# EAGLE schematic GPS_radiologger_v1 (EAGLE 9.4.2)
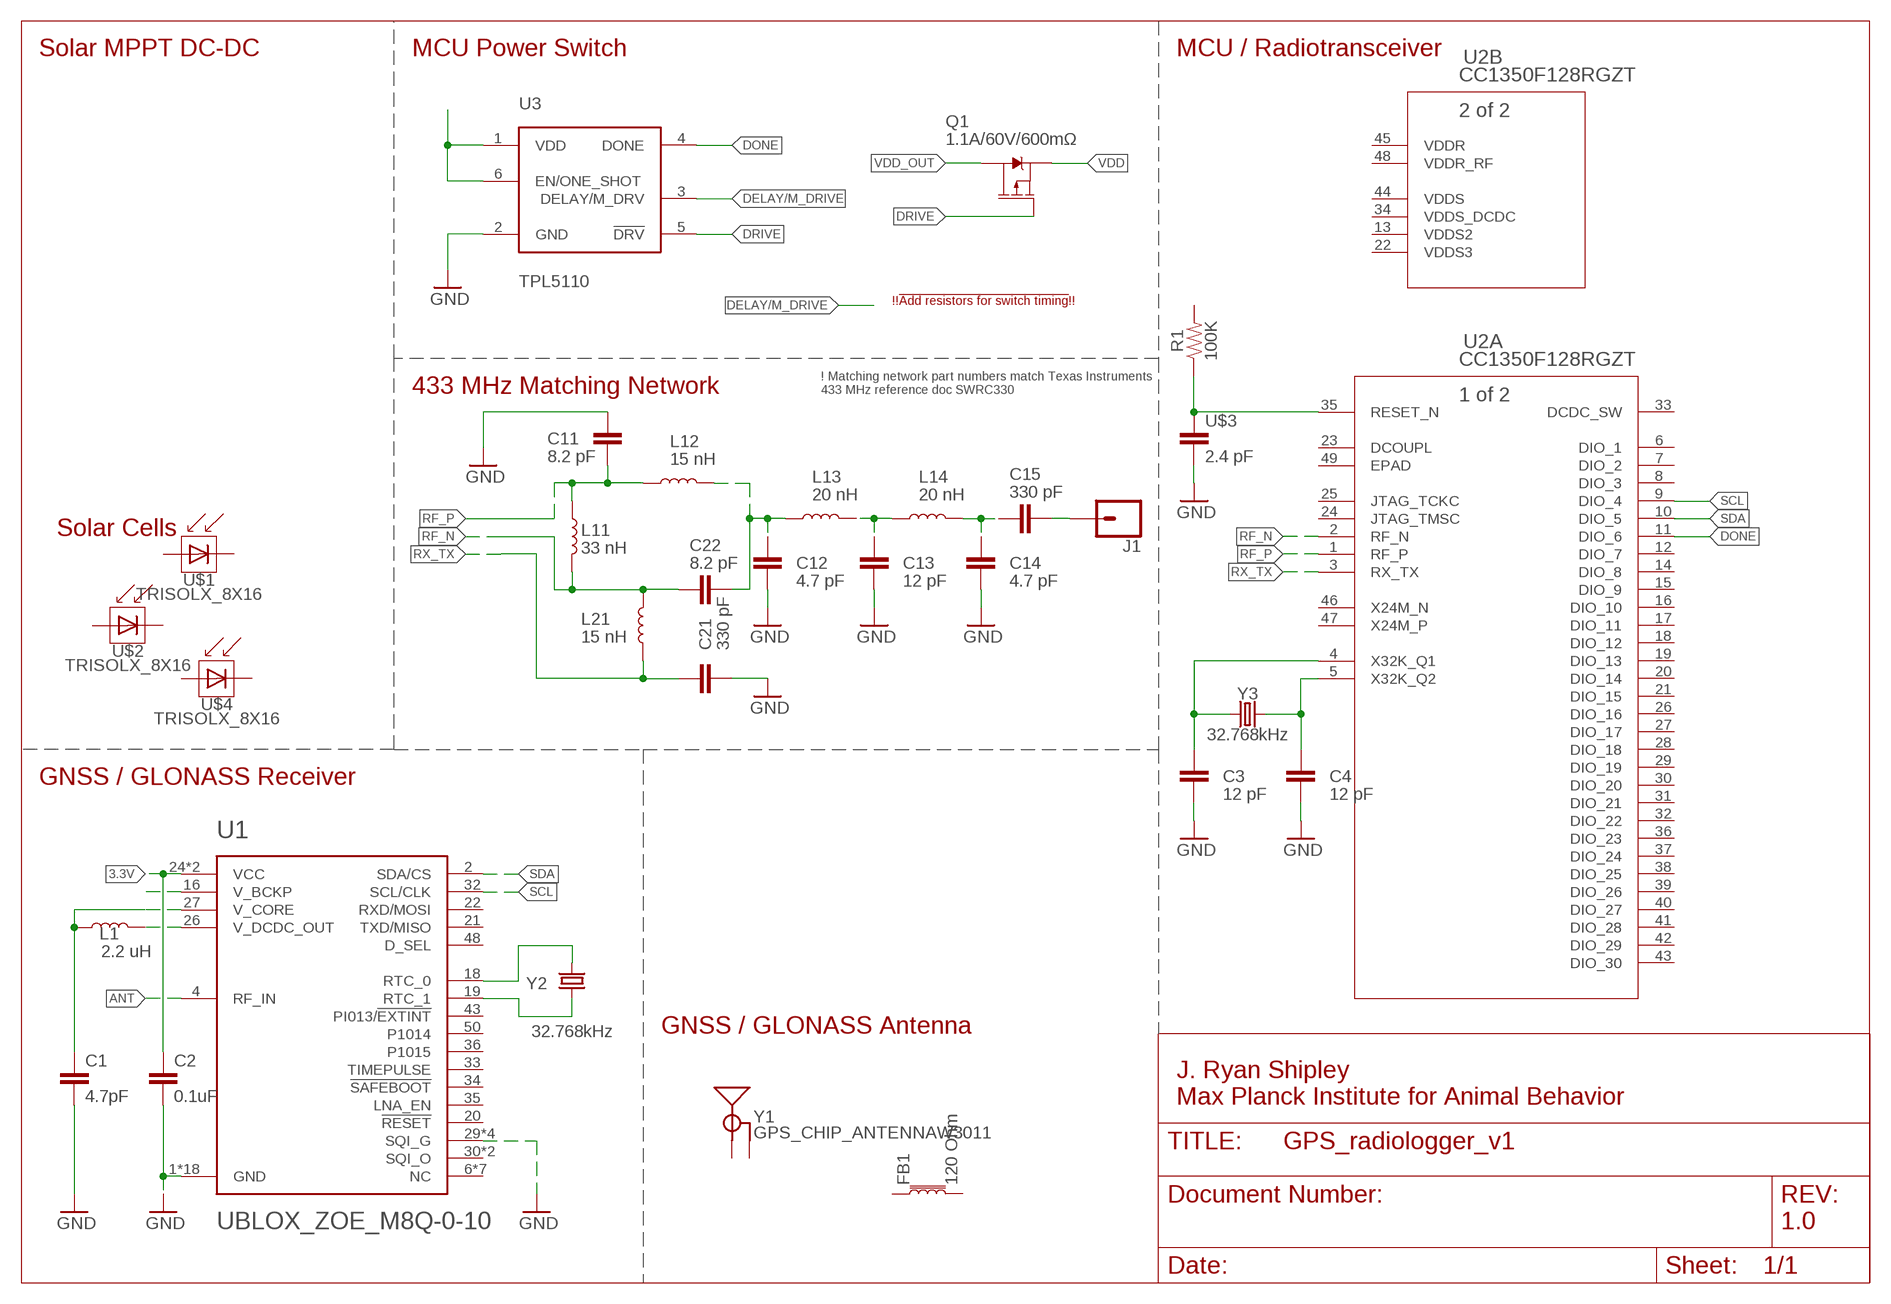
[diagram p0: schematic, sheet 1]

## Parts
C1  4.7pF  4.7PF-0603-50V-5%  [0603]
C2  0.1uF  0.1UF-0402-16V-10%  [0402]
C3  12 pF  0.1UF-0402T-16V-10%  [0402-TIGHT]
C4  12 pF  0.1UF-0402T-16V-10%  [0402-TIGHT]
C11  8.2 pF  0.1UF-0402T-16V-10%  [0402-TIGHT]
C12  4.7 pF  0.1UF-0402T-16V-10%  [0402-TIGHT]
C13  12 pF  0.1UF-0402T-16V-10%  [0402-TIGHT]
C14  4.7 pF  0.1UF-0402T-16V-10%  [0402-TIGHT]
C15  330 pF  0.1UF-0402T-16V-10%  [0402-TIGHT]
C21  330 pF  0.1UF-0402T-16V-10%  [0402-TIGHT]
C22  8.2 pF  0.1UF-0402T-16V-10%  [0402-TIGHT]
FB1  120 Ohm  FERRITE_BEAD-120_OHM-0402  [0402]
J1  CONN_01OFFSET  [1X01_OFFSET]
L1  2.2 uH  2.2μH_SHIELDED_INDUCTOR  [0806]
L11  33 nH  19NH-0402  [0402_MURATA]
L12  15 nH  19NH-0402  [0402_MURATA]
L13  20 nH  19NH-0402  [0402_MURATA]
L14  20 nH  19NH-0402  [0402_MURATA]
L21  15 nH  19NH-0402  [0402_MURATA]
Q1  1.1A/60V/600mΩ  MOSFET_PCH-SI2309DS  [SOT23-3]
R1  100K  100KOHM-0402-1/16W-1%  [0402]
U1  UBLOX_ZOE_M8Q-0-10  [UBLOX_ZOE_M8-0-10]
U2  CC1350F128RGZT  [RGZ48]
U3  TPL5110  [SOT23-6]
U$1  TRISOLX_8X16  [TRISOLX_8X16]
U$2  TRISOLX_8X16  [TRISOLX_8X16]
U$3  2.4 pF  2.4PF-0402  [0402_MURATA]
U$4  TRISOLX_8X16  [TRISOLX_8X16]
Y1  GPS_CHIP_ANTENNAW3011  [W3011]
Y2  32.768kHz  CRYSTAL-32.768KHZSMD-3.2X1.5  [CRYSTAL-SMD-3.2X1.5MM]
Y3  32.768kHz  CRYSTAL-32.768KHZSMD-3.2X1.5  [CRYSTAL-SMD-3.2X1.5MM]

## Nets
3.3V: C2.1 U1.24(VCC) U1.25(VCC)
ANT: U1.4(RF_IN)
DELAY/M_DRIVE: U3.3(DELAY/M_DRV)
DONE: U2.11(A:DIO_6) U3.4(DONE)
DRIVE: Q1.1(G) U3.5(!DRV)
GND: C1.2 C2.2 C3.2 C4.2 C11.2 C12.2 C13.2 C14.2 C21.2 U1.1(GND) U1.3(GND) U1.5(GND) U1.7(GND) U1.8(GND) U1.9(GND) U1.10(GND) U1.11(GND) U1.12(GND) U1.17(GND) U1.23(GND) U1.29(SQI_G) U1.31(SQI_G) U1.37(GND) U1.38(GND) U1.39(GND) U1.40(GND) U1.41(GND) U1.44(GND) U1.46(SQI_G) U1.47(SQI_G) U1.49(GND) U3.2(GND) U$3.P$2
N$1: U1.16(V_BCKP)
N$2: C1.1 L1.1 U1.27(V_CORE)
N$3: L1.2 U1.26(V_DCDC_OUT)
N$4: U1.18(RTC_0) Y2.P$2
N$5: U1.19(RTC_1) Y2.P$1
N$6: U3.1(VDD) U3.6(EN/ONE_SHOT)
N$7: C13.1 L13.P$2 L14.P$1
N$8: C14.1 C15.1 L14.P$2
N$9: C12.1 C22.1 L12.P$2 L13.P$1
N$10: C15.2 J1.1
N$11: C3.1 U2.4(A:X32K_Q1) Y3.P$1
N$12: C4.1 U2.5(A:X32K_Q2) Y3.P$2
N$13: R1.1 U2.35(A:RESET_N) U$3.P$1
RF_N: C22.2 L11.P$2 L21.P$2 U2.2(A:RF_N)
RF_P: C11.1 L11.P$1 L12.P$1 U2.1(A:RF_P)
RX_TX: C21.1 L21.P$1 U2.3(A:RX_TX)
SCL: U1.32(SCL/CLK) U2.9(A:DIO_4)
SDA: U1.2(SDA/CS) U2.10(A:DIO_5)
VDD: Q1.2(S)
VDD_OUT: Q1.3(D)
Unconnected: FB1.1 FB1.2 R1.2 U1.6(NC) U1.13(NC) U1.14(NC) U1.15(NC) U1.20(!RESET) U1.21(TXD/MISO) U1.22(RXD/MOSI) U1.28(NC) U1.30(SQI_O) U1.33(TIMEPULSE) U1.34(!SAFEBOOT) U1.35(LNA_EN) U1.36(P1015) U1.42(NC) U1.43(PI013/!EXTINT) U1.45(SQI_O) U1.48(D_SEL) U1.50(P1014) U1.51(NC) U2.6(A:DIO_1) U2.7(A:DIO_2) U2.8(A:DIO_3) U2.12(A:DIO_7) U2.14(A:DIO_8) U2.15(A:DIO_9) U2.16(A:DIO_10) U2.17(A:DIO_11) U2.18(A:DIO_12) U2.19(A:DIO_13) U2.20(A:DIO_14) U2.21(A:DIO_15) U2.23(A:DCOUPL) U2.24(A:JTAG_TMSC) U2.25(A:JTAG_TCKC) U2.26(A:DIO_16) U2.27(A:DIO_17) U2.28(A:DIO_18) U2.29(A:DIO_19) U2.30(A:DIO_20) U2.31(A:DIO_21) U2.32(A:DIO_22) U2.33(A:DCDC_SW) U2.36(A:DIO_23) U2.37(A:DIO_24) U2.38(A:DIO_25) U2.39(A:DIO_26) U2.40(A:DIO_27) U2.41(A:DIO_28) U2.42(A:DIO_29) U2.43(A:DIO_30) U2.46(A:X24M_N) U2.47(A:X24M_P) U2.49(A:EPAD) U$1.P$2(A) U$1.P$3(C) U$2.P$2(A) U$2.P$3(C) U$4.P$2(A) U$4.P$3(C) Y1.1(SIGNAL) Y1.2(GND) Y1.3(GND)

## Notes on the sheet
- Solar MPPT DC-DC | MCU Power Switch | MCU / Radiotransceiver
- !!!Add resistors for switch timing!!!
- 433 MHz Matching Network
- ! Matching network part numbers match Texas Instruments 
  433 MHz reference doc SWRC330
- Solar Cells
- GNSS / GLONASS Receiver
- GNSS / GLONASS Antenna
- J. Ryan Shipley
  Max Planck Institute for Animal Behavior
- 1.0

## Power pins joined to a net without a drawn wire
VDDR: U2.45(B:VDDR)
VDDR_RF: U2.48(B:VDDR_RF)
VDDS: U2.44(B:VDDS)
VDDS2: U2.13(B:VDDS2)
VDDS3: U2.22(B:VDDS3)
VDDS_DCDC: U2.34(B:VDDS_DCDC)

## Library data of the parts
C1 = SparkFun-Capacitors:4.7PF: 4.7pF ceramic capacitors A capacitor is a passive two-terminal electrical component used to store electrical energy temporarily in an electric field.; PROD_ID: CAP-07880
C2 = SparkFun-Capacitors:0.1UF: 0.1µF ceramic capacitors A capacitor is a passive two-terminal electrical component used to store electrical energy temporarily in an electric field.; PROD_ID: CAP-12416
C3 C4 C11-C15 C21 C22 = SparkFun-Capacitors:0.1UF: 0.1µF ceramic capacitors A capacitor is a passive two-terminal electrical component used to store electrical energy temporarily in an electric field.; PROD_ID: CAP-12416; VALUE: 0.1uF
FB1 = SparkFun-Coils:FERRITE_BEAD-120_OHM: Ferrite Bead (blocks, cores, rings, chokes, etc.) Inductor with layers of ferrite used to suppress high frequencies. Often used to isolate high frequency noise.; MFG_PART: BLM15HB121SN1D; PROD_ID: NDUC-14206
J1 = SparkFun-Connectors:CONN_01: Single connection point. Often used as Generic Header-pin footprint for 0.1 inch spaced/style header connections On any of the 0.1 inch spaced packages, you can populate with these: Break Away Headers - Straight <https://www.sparkfun.com/products/116> (PRT-00116) Break Away Male Headers - Right Angle <https://www.sparkfun.com/products/553> (PRT-00553) Female Headers <https://www.sparkfun.com/products/115> (PRT-00115) Break Away Headers - Machine Pin <https://www.sparkfun.com/products/117> (PRT-00117) Break Away Female Headers - Swiss Machine Pin <https://www.sparkfun.com/products/743> (PRT-00743) This device is also useful as a general connection point to wire up your design to another part of your project. Our various solder wires solder well into these plated through hole pads. Hook-Up Wire - Assortment (Stranded, 22 AWG) <https://www.sparkfun.com/products/11375> (PRT-11375) Hook-Up Wire - Assortment (Solid Core, 22 AWG) <https://www.sparkfun.com/products/11367> (PRT-11367) View the entire wire category on our website here <https://www.sparkfun.com/categories/141> Special notes: SMTSO-256-ET is a "flush mount" nut for a 4-40 screw. We mostly use this on specialty testbeds; it is a nice way to connect hardware to your PCB at an adjustable hieght. Also note, the SNAP packages are for using a snappable style connector. We sell a baggie of snaps and they are also used on two LilyPad designs: Snap Assortment - 30 pack (male and female) <https://www.sparkfun.com/products/11347> (DEV-11347) LilyPad Arduino SimpleSnap <https://www.sparkfun.com/products/10941> (DEV-10941) LilyPad SimpleSnap Protoboard <https://www.sparkfun.com/products/10940> (DEV-10940)
L1 = SparkFun-Coils:2.2μH_SHIELDED_INDUCTOR: Murata 2.2uH Inductor 2.2uH 1.2A 110mOhm 0806 Package Shielded; PROD_ID: NDUC-14257
L11-L14 L21 = SparkFun-Coils:19NH; PROD_ID: NDUC-14352; VALUE: 19 nH
Q1 = SparkFun-DiscreteSemi:MOSFET_PCH: P-channel MOSFETs Voltage controlled devices that allow control of high current outputs. SparkFun Products: SparkFun ESP32 Thing <https://www.sparkfun.com/products/13907> SparkFun ESP8266 Thing <https://www.sparkfun.com/products/13231>; PROD_ID: TRANS-08285
R1 = SparkFun-Resistors:100KOHM: 100kΩ resistor A resistor is a passive two-terminal electrical component that implements electrical resistance as a circuit element. Resistors act to reduce current flow, and, at the same time, act to lower voltage levels within circuits. - Wikipedia; PROD_ID: RES-13495
U1 = SparkFun-GPS:UBLOX_ZOE_M8Q-0-10: UBLOX ZOE-M8Q-0-10 u-blox ZOE-M8 standard precision GNSS SiP (System in Package) modules feature the high performance u-blox M8 GNSS engine. ZOE-M8’s ultra-miniature form factor integrates a complete GNSS receiver including SAW filter, LNA and TCXO. Handles all GNSS systems and can simulatenously use up to three of them, with accuracy ranging from 2.5m to 4m. GPS GLONASS BeiDou Galileo This can be corrected with the SBAS or QZSS augmentation systems.; PROD_ID: IC-14251
U2 = CC1350F128RGZT:CC1350F128RGZT; MANUFACTURER_PART_NUMBER: CC1350F128RGZT; VENDOR: Texas Instruments
U3 = SparkFun-IC-Power:TPL5110: TPL5110 Nano-Power System Timer for Power Gating The TPL5110 Nano Timer is a low power timer with an integrated MOSFET driver designed for power gating in duty cycled or battery-powered applications. Consuming only 35 nA, the TPL5110 can enable the power supply line and drastically reduce the overall system stand by current during the sleep time.; PROD_ID: IC-14387
U$1 U$2 U$4 = TrisolX_Solar_Cells:TRISOLX_8X16
U$3 = SparkFun-Capacitors:2.4PF; PROD_ID: CAP-14351
Y1 = SparkFun-GPS:GPS_CHIP_ANTENNA; PROD_ID: ANT-14304
Y2 Y3 = SparkFun-Clocks:CRYSTAL-32.768KHZ: 32.768kHz Crystal Frequency: 32.768kHz Frequency Stability: ±20ppm Load Capacitance: 12.5pF (PTH-2X6 & SMD-3.2X1.5), 6pF (SMD-2X6) SparkFun Products: SparkFun BigTime Watch Kit <https://www.sparkfun.com/products/11734> SparkFun nRF52832 Breakout <https://www.sparkfun.com/products/13990> SparkFun Real Time Clock Module <https://www.sparkfun.com/products/12708>; PROD_ID: XTAL-13062